# Altium project Audio_Moduloop.PrjPcb (part 2 of 2)
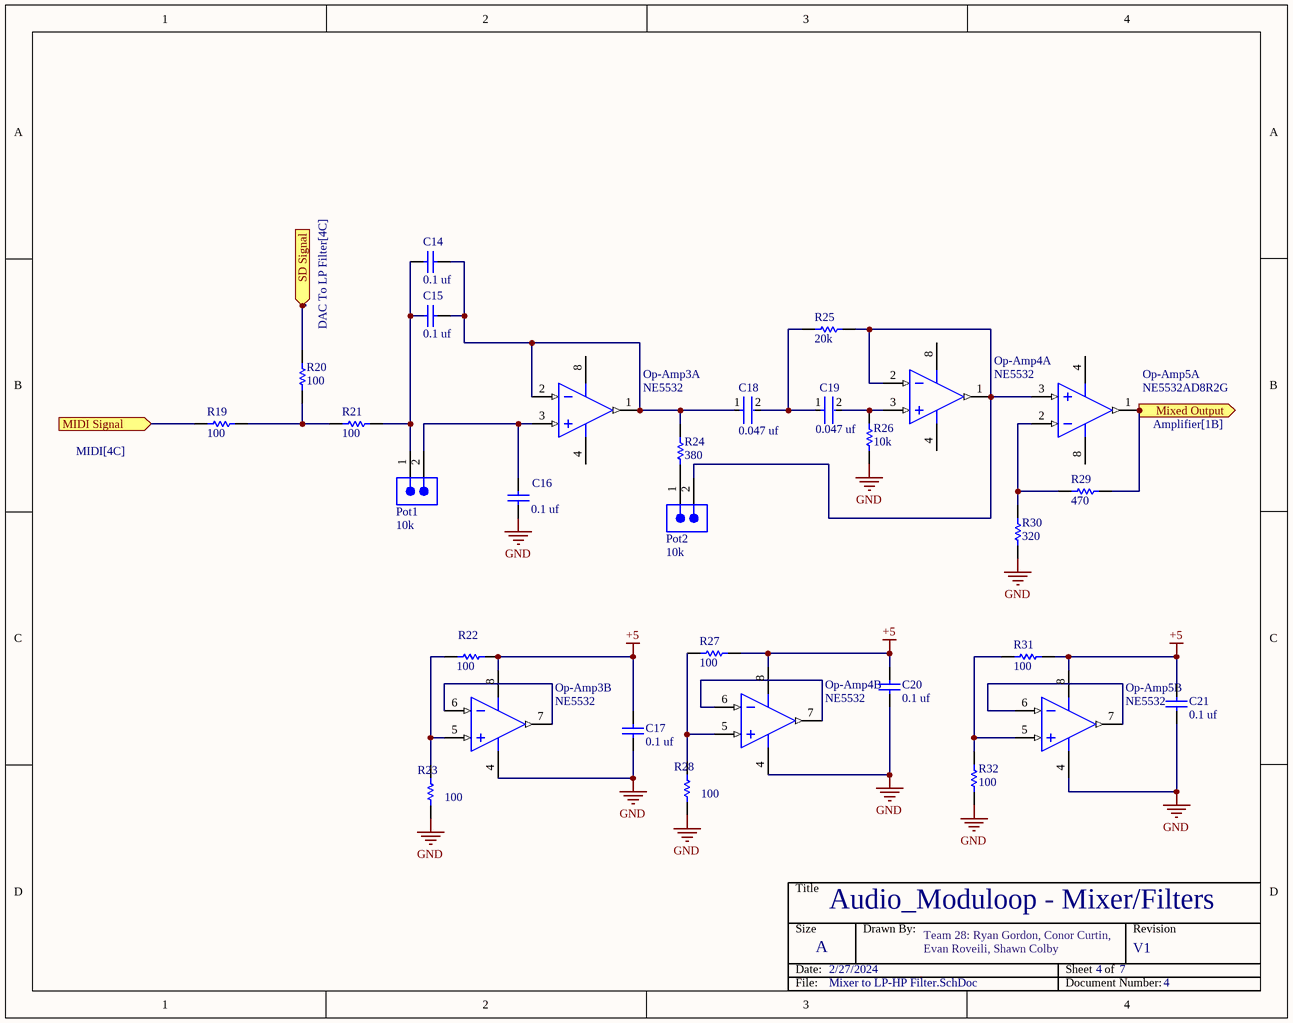
[diagram p7: Mixer to LP-HP Filter.SchDoc]

## Nets that join several sheets
3.3V: MIDI (MIDI_Chip.2), DAC To LP Filter (R12.2), LCD-Battery (C32.1 PWR/GND.3 VR2.2)
+5: Audio_Moduloop (Teensy_4.1.42), MIDI (5 pins), Amplifier (Amp.6), DAC To LP Filter (C13.1 Op-Amp2.8 R17.2), Button Decoding (5 pins), LCD-Battery (10 pins), Mixer to LP-HP Filter (9 pins)
GND: Audio_Moduloop (Teensy_4.1.46), MIDI (10 pins), Amplifier (10 pins), DAC To LP Filter (7 pins), Button Decoding (11 pins), LCD-Battery (16 pins), Mixer to LP-HP Filter (12 pins)
NetBut._Col_9: Audio_Moduloop (Teensy_4.1.8), Button Decoding (But._Col.9)
NetC3_1: MIDI (C3.1 Op-Amp1.1 Op-Amp1.2), Mixer to LP-HP Filter (R19.1)
NetC11_1: DAC To LP Filter (C11.1 Op-Amp2.1 Op-Amp2.2), Mixer to LP-HP Filter (R20.1)
NetC22_2: Amplifier (C22.2 R33.2), Mixer to LP-HP Filter (Op-Amp5.1 R29.2)
NetDec1_1: Audio_Moduloop (Teensy_4.1.12), Button Decoding (Dec1.1)
NetDec1_2: Audio_Moduloop (Teensy_4.1.11), Button Decoding (Dec1.2)
NetDec1_3: Audio_Moduloop (Teensy_4.1.10), Button Decoding (Dec1.3)
NetDec1_6: Audio_Moduloop (Teensy_4.1.24), Button Decoding (Dec1.6 Dec2.6)
NetDec2_1: Audio_Moduloop (Teensy_4.1.27), Button Decoding (Dec2.1)
NetDec2_2: Audio_Moduloop (Teensy_4.1.26), Button Decoding (Dec2.2)
NetDec2_3: Audio_Moduloop (Teensy_4.1.25), Button Decoding (Dec2.3)
NetDec3_1: Audio_Moduloop (Teensy_4.1.32), Button Decoding (Dec3.1)
NetDec3_2: Audio_Moduloop (Teensy_4.1.31), Button Decoding (Dec3.2)
NetDec3_3: Audio_Moduloop (Teensy_4.1.30), Button Decoding (Dec3.3)
NetDec3_6: Audio_Moduloop (Teensy_4.1.29), Button Decoding (Dec3.6)
NetLCD1_1: Audio_Moduloop (Teensy_4.1.19), LCD-Battery (LCD1.1)
NetLCD1_2: Audio_Moduloop (Teensy_4.1.18), LCD-Battery (LCD1.2)
NetLED_Col_9: Audio_Moduloop (Teensy_4.1.28), Button Decoding (LED_Col.9)
NetMenu_Input_5: Audio_Moduloop (Teensy_4.1.17), LCD-Battery (Menu_Input.5 R37.1)
NetMenu_Input_6: Audio_Moduloop (Teensy_4.1.16), LCD-Battery (Menu_Input.6 R38.1)
NetMenu_Input_7: Audio_Moduloop (Teensy_4.1.15), LCD-Battery (Menu_Input.7 R39.1)
NetMenu_Input_8: Audio_Moduloop (Teensy_4.1.14), LCD-Battery (Menu_Input.8 R40.1)
NetMIDI_Chip_1: Audio_Moduloop (Teensy_4.1.9), MIDI (MIDI_Chip.1)
NetMIDI_Chip_15: Audio_Moduloop (Teensy_4.1.1), MIDI (MIDI_Chip.15)
NetPT2811_1: Audio_Moduloop (Teensy_4.1.4), DAC To LP Filter (PT2811.1)
NetPT2811_2: Audio_Moduloop (Teensy_4.1.3), DAC To LP Filter (PT2811.2)
NetPT2811_3: Audio_Moduloop (Teensy_4.1.2), DAC To LP Filter (PT2811.3)
NetTeensy_4.1_33: Audio_Moduloop (Teensy_4.1.33), LCD-Battery (Teensy_Pins.1)
NetTeensy_4.1_34: Audio_Moduloop (Teensy_4.1.34), LCD-Battery (Teensy_Pins.2)
NetTeensy_4.1_35: Audio_Moduloop (Teensy_4.1.35), LCD-Battery (Teensy_Pins.3)
NetTeensy_4.1_36: Audio_Moduloop (Teensy_4.1.36), LCD-Battery (Teensy_Pins.4)
NetTeensy_4.1_37: Audio_Moduloop (Teensy_4.1.37), LCD-Battery (Teensy_Pins.5)
NetTeensy_4.1_38: Audio_Moduloop (Teensy_4.1.38), LCD-Battery (Teensy_Pins.6)
NetTeensy_4.1_39: Audio_Moduloop (Teensy_4.1.39), LCD-Battery (Teensy_Pins.7)
NetTeensy_4.1_40: Audio_Moduloop (Teensy_4.1.40), LCD-Battery (Teensy_Pins.8)
NetTeensy_4.1_41: Audio_Moduloop (Teensy_4.1.41), LCD-Battery (Teensy_Pins.9)